# EAGLE design untitled (EAGLE 5.06)
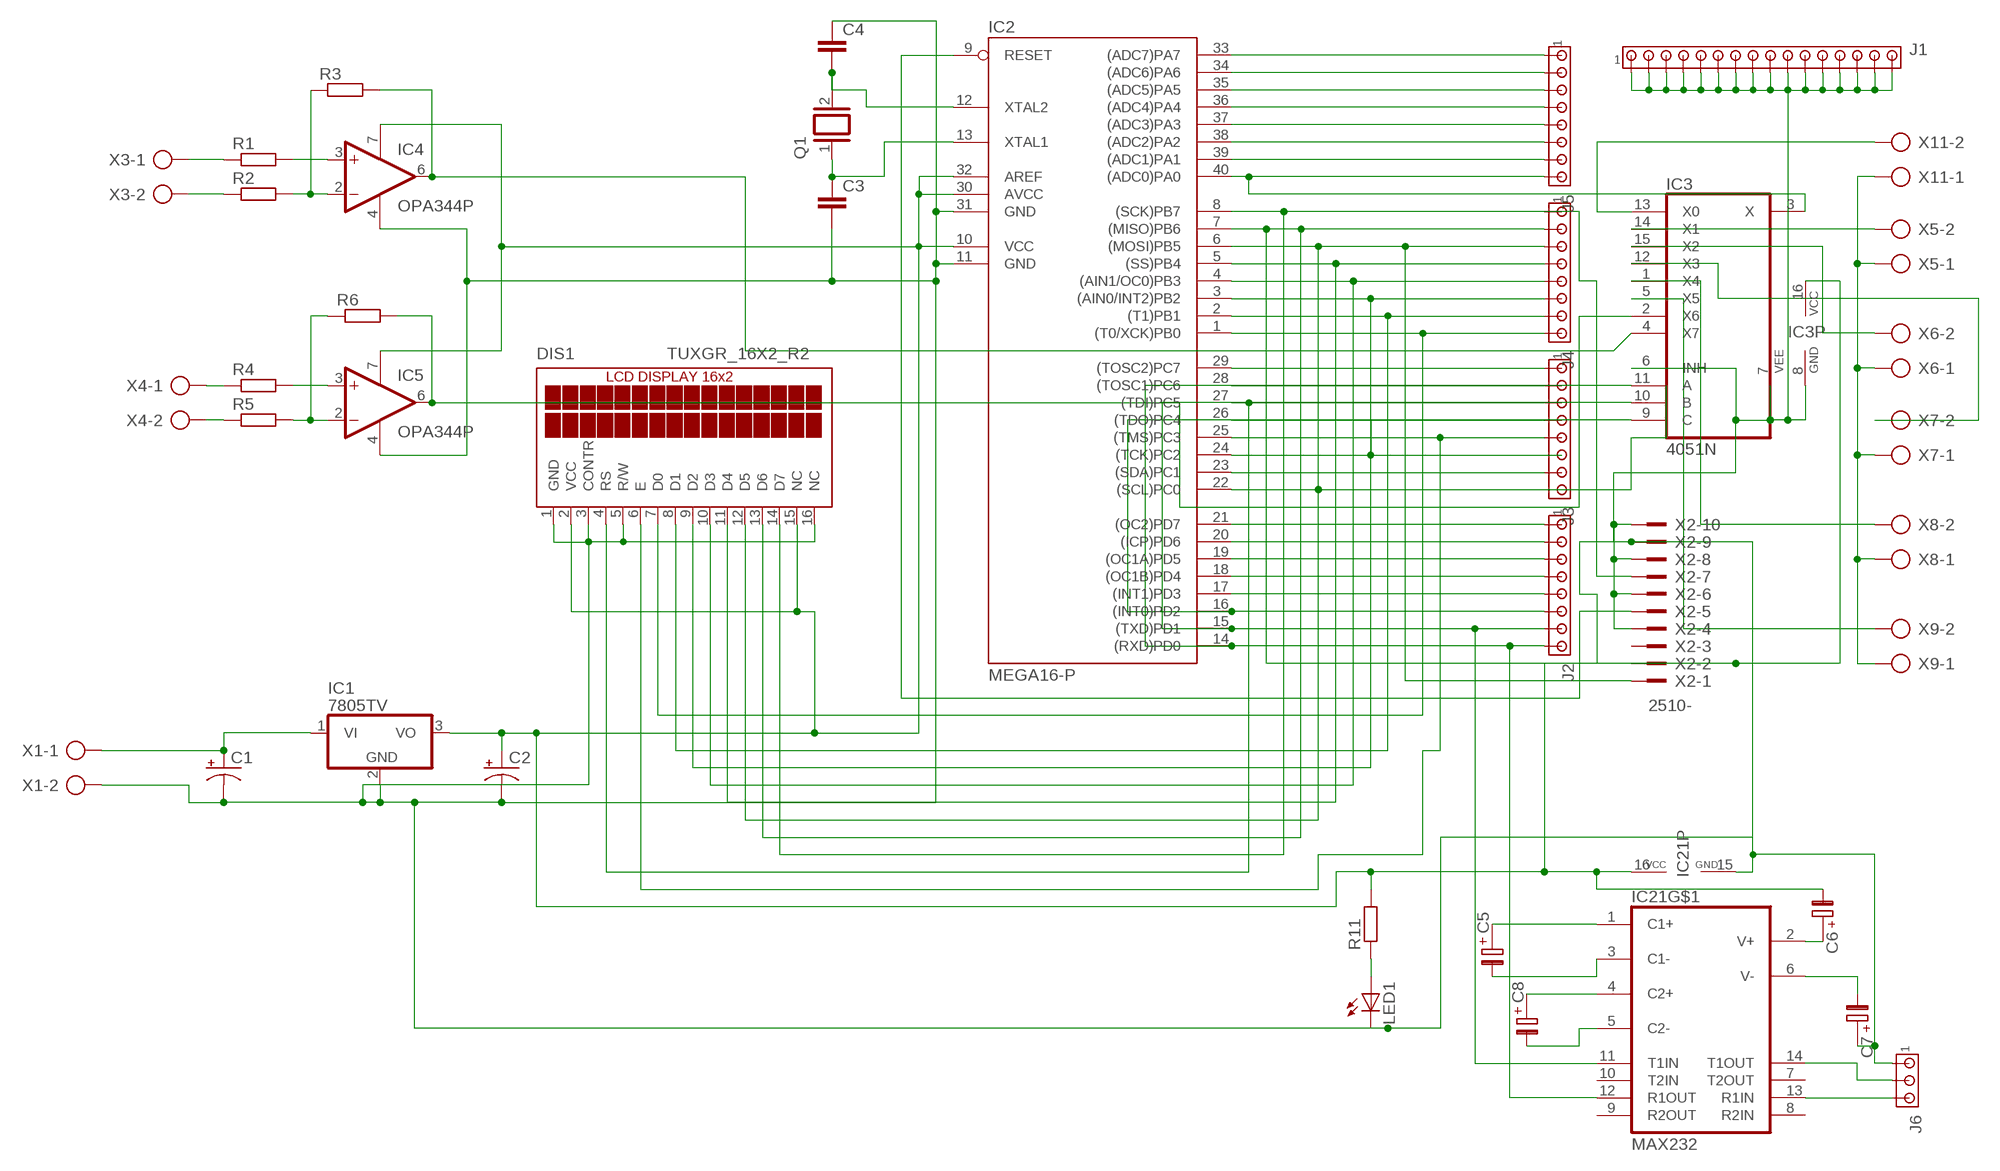
[diagram p0: schematic, sheet 1]

## Parts
C1  CPOL-USE5-8.5  [E5-8,5]
C2  CPOL-USE5-8.5  [E5-8,5]
C3  C2.5/2  [C2.5-2]
C4  C2.5/2  [C2.5-2]
C5  C-PR-2,5X6  [E2,5-6]
C6  C-PR-2,5X6  [E2,5-6]
C7  C-PR-2,5X6  [E2,5-6]
C8  C-PR-2,5X6  [E2,5-6]
DIS1  TUXGR_16X2_R2  [TUXGR_16X2_R2]
IC1  7805TV  [TO220V]
IC2  MEGA16-P  [DIL40]
IC3  4051N  [DIL16]
IC4  OPA344P  [DIL08]
IC5  OPA344P  [DIL08]
IC21  MAX232  [DIL16]
J1  MTA16-156  [1X16MTA]
J2  MTA08-100  [10X08MTA]
J3  MTA08-100  [10X08MTA]
J4  MTA08-100  [10X08MTA]
J5  MTA08-100  [10X08MTA]
J6  MTA03-100  [10X03MTA]
LED1  LED5MM  [LED5MM]
Q1  XTAL/S  [QS]
R1  R-EU_0204/7  [0204/7]
R2  R-EU_0204/7  [0204/7]
R3  R-EU_0204/7  [0204/7]
R4  R-EU_0204/7  [0204/7]
R5  R-EU_0204/7  [0204/7]
R6  R-EU_0204/7  [0204/7]
R11  R-EU_0207/10  [0207/10]
X1  AK300/2  [AK300/2]
X2  2510-  [PAK100/2500-10]
X3  AK300/2  [AK300/2]
X4  AK300/2  [AK300/2]
X5  AK300/2  [AK300/2]
X6  AK300/2  [AK300/2]
X7  AK300/2  [AK300/2]
X8  AK300/2  [AK300/2]
X9  AK300/2  [AK300/2]
X11  AK300/2  [AK300/2]

## Nets
N$1: C1.+ IC1.1(VI) X1.1
N$2: IC2.21((OC2)PD7) J2.1
N$3: IC2.33((ADC7)PA7) J5.1
N$4: IC2.23((SDA)PC1) J3.7
N$5: IC2.34((ADC6)PA6) J5.2
N$6: IC2.35((ADC5)PA5) J5.3
N$7: C4.2 IC2.12(XTAL2) Q1.2
N$8: C3.1 IC2.13(XTAL1) Q1.1
N$9: IC2.36((ADC4)PA4) J5.4
N$10: IC2.37((ADC3)PA3) J5.5
N$11: IC2.40((ADC0)PA0) IC3.3(X) J5.8
N$12: IC2.39((ADC1)PA1) J5.7
N$13: IC2.38((ADC2)PA2) J5.6
N$14: C2.+ C6.- DIS1.2(VCC) DIS1.15(NC) IC1.3(VO) IC2.10(VCC) IC2.30(AVCC) IC2.32(AREF) IC3.16(VCC) IC4.7(V+) IC5.7(V+) IC21.16(P:VCC) R11.2 X2.2
N$15: IC3.5(X5) X9.2
N$16: LED1.A R11.1
N$17: IC2.20((ICP)PD6) J2.2
N$19: IC3.4(X7) IC4.6(OUT) R3.2
N$20: IC4.2(-IN) R2.2 R3.1
N$21: IC5.3(+IN) R4.2
N$22: IC4.3(+IN) R1.2
N$23: R1.1 X3.1
N$24: R2.1 X3.2
N$25: IC3.2(X6) IC5.6(OUT) R6.2
N$26: IC5.2(-IN) R5.2 R6.1
N$27: R4.1 X4.1
N$28: R5.1 X4.2
N$29: IC2.22((SCL)PC0) J3.8
N$31: X5.1 X6.1 X7.1 X8.1 X9.1 X11.1
N$32: IC3.13(X0) X11.2
N$33: IC3.14(X1) X5.2
N$34: IC3.15(X2) X6.2
N$35: IC3.12(X3) X7.2
N$36: IC3.1(X4) X8.2
N$39: C1.- C2.- C3.2 C4.1 C7.+ DIS1.1(GND) DIS1.3(CONTR) DIS1.5(R/W) DIS1.16(NC) IC1.2(GND) IC2.11(GND) IC2.31(GND) IC3.6(INH) IC3.7(VEE) IC3.8(GND) IC4.4(V-) IC5.4(V-) IC21.15(P:GND) J1.1 J1.2 J1.3 J1.4 J1.5 J1.6 J1.7 J1.8 J1.9 J1.10 J1.11 J1.12 J1.13 J1.14 J1.15 J1.16 J6.1 LED1.K(C) X1.2 X2.4 X2.6 X2.8 X2.10
N$40: C5.+ IC21.1(C1+)
N$41: C5.- IC21.3(C1-)
N$42: C8.+ IC21.4(C2+)
N$43: IC2.29((TOSC2)PC7) J3.1
N$44: IC2.28((TOSC1)PC6) J3.2
N$45: DIS1.4(RS) IC2.27((TDI)PC5) J3.3
N$46: IC2.26((TDO)PC4) J3.4
N$48: IC2.24((TCK)PC2) J3.6
N$49: IC2.9(RESET) X2.5
N$51: DIS1.7(D0) IC2.1((T0/XCK)PB0) J4.8
N$52: DIS1.8(D1) IC2.2((T1)PB1) J4.7
N$53: DIS1.9(D2) IC2.3((AIN0/INT2)PB2) J4.6
N$54: DIS1.10(D3) IC2.4((AIN1/OC0)PB3) J4.5
N$55: DIS1.11(D4) IC2.5((SS)PB4) J4.4
N$56: DIS1.12(D5) IC2.6((MOSI)PB5) J4.3 X2.1
N$57: DIS1.13(D6) IC2.7((MISO)PB6) J4.2 X2.9
N$58: DIS1.14(D7) IC2.8((SCK)PB7) J4.1 X2.7
N$59: IC2.19((OC1A)PD5) J2.3
N$60: C8.- IC21.5(C2-)
N$61: IC2.18((OC1B)PD4) J2.4
N$62: IC2.17((INT1)PD3) J2.5
N$63: IC2.16((INT0)PD2) IC3.9(C) J2.6
N$65: DIS1.6(E) IC2.25((TMS)PC3) J3.5
N$67: C6.+ IC21.2(V+)
N$68: C7.- IC21.6(V-)
N$69: IC2.15((TXD)PD1) IC3.10(B) IC21.11(T1IN) J2.7
N$85: IC21.14(T1OUT) J6.2
N$87: IC21.13(R1IN) J6.3
N$89: IC2.14((RXD)PD0) IC3.11(A) IC21.12(R1OUT) J2.8
Unconnected: IC21.7(T2OUT) IC21.8(R2IN) IC21.9(R2OUT) IC21.10(T2IN) X2.3

## Library data of the parts
C1 C2 = resistor:CPOL-US: POLARIZED CAPACITOR, American symbol
C3 C4 = capacitor-wima:C: CAPACITOR naming: grid - package width
C5-C8 = cap-pan40:C-PR: POLARIZED ELECTROLYTIC/TANTALUM
DIS1 = display-lcd:TUXGR_16X2_R2: Tuxgraphics LCD display 16x2 characters reflective, without background light Source: tuxgr_12x2_r2.pdf
IC1 = linear:78*: Positive VOLTAGE REGULATOR Source: http://cache.national.com/ds/LM/LM78L05.pdf http://www.fairchildsemi.com/ds/LM/LM7805.pdf
IC2 = atmel:MEGA16-P: MICROCONTROLLER 16 Kbytes FLASH 1 kbytes SRAM 512 bytes EEPROM USART 8-channel 10 bit ADC Source: avr.lbr
IC3 = 40xx:4051: 8-channel ANALOG MULTIPLEXER
IC4 IC5 = linear3:OPA*: Single Operational Amplifier Low Power, Single-Supply, Rail-To-Rail Operational Amplifier Source: http://focus.ti.com/lit/ds/symlink/opa2345.pdf
IC21 = maxim:MAX232: RS232 TRANSEIVER
J1 = con-amp:MTA16-156: AMP connector
J2-J5 = con-amp:MTA08-100: AMP connector
J6 = con-amp:MTA03-100: AMP connector
LED1 = led:LED: LED OSRAM: - CHIPLED LG R971, LG N971, LY N971, LG Q971, LY Q971, LO R971, LY R971 LH N974, LH R974 LS Q976, LO Q976, LY Q976 LO Q996 - Hyper CHIPLED LW Q18S LB Q993, LB Q99A, LB R99A - SideLED LS A670, LO A670, LY A670, LG A670, LP A670 LB A673, LV A673, LT A673, LW A673 LH A674 LY A675 LS A676, LA A676, LO A676, LY A676, LW A676 LS A679, LY A679, LG A679 - Hyper Micro SIDELED® LS Y876, LA Y876, LO Y876, LY Y876 LT Y87S - SmartLED LW L88C, LW L88S LB L89C, LB L89S, LG L890 LS L89K, LO L89K, LY L89K LS L896, LA L896, LO L896, LY L896 - TOPLED LS T670, LO T670, LY T670, LG T670, LP T670 LSG T670, LSP T670, LSY T670, LOP T670, LYG T670 LG T671, LOG T671, LSG T671 LB T673, LV T673, LT T673, LW T673 LH T674 LS T676, LA T676, LO T676, LY T676, LB T676, LH T676, LSB T676, LW T676 LB T67C, LV T67C, LT T67C, LS T67K, LO T67K, LY T67K, LW E67C LS E67B, LA E67B, LO E67B, LY E67B, LB E67C, LV E67C, LT E67C LW T67C LS T679, LY T679, LG T679 LS T770, LO T770, LY T770, LG T770, LP T770 LB T773, LV T773, LT T773, LW T773 LH T774 LS E675, LA E675, LY E675, LS T675 LS T776, LA T776, LO T776, LY T776, LB T776 LHGB T686 LT T68C, LB T68C - Hyper Mini TOPLED® LB M676 - Mini TOPLED Santana® LG M470 LS M47K, LO M47K, LY M47K Source: http://www.osram.convergy.de LUXEON: - LUMILED® LXK2-PW12-R00, LXK2-PW12-S00, LXK2-PW14-U00, LXK2-PW14-V00 LXK2-PM12-R00, LXK2-PM12-S00, LXK2-PM14-U00 LXK2-PE12-Q00, LXK2-PE12-R00, LXK2-PE12-S00, LXK2-PE14-T00, LXK2-PE14-U00 LXK2-PB12-K00, LXK2-PB12-L00, LXK2-PB12-M00, LXK2-PB14-N00, LXK2-PB14-P00, LXK2-PB14-Q00 LXK2-PR12-L00, LXK2-PR12-M00, LXK2-PR14-Q00, LXK2-PR14-R00 LXK2-PD12-Q00, LXK2-PD12-R00, LXK2-PD12-S00 LXK2-PH12-R00, LXK2-PH12-S00 LXK2-PL12-P00, LXK2-PL12-Q00, LXK2-PL12-R00 Source: www.luxeon.com KINGBRIGHT: KA-3528ASYC Source: www.kingbright.com
Q1 = special:XTAL/S: CRYSTAL
R1-R6 R11 = rcl:R-EU_: RESISTOR, European symbol
X1 X3-X9 X11 = con-ptr500:AK300/2: CONNECTOR
X2 = con-3m:2510-: 3M (TM) Pak 100 4-Wall Header Source: 3M

## Board
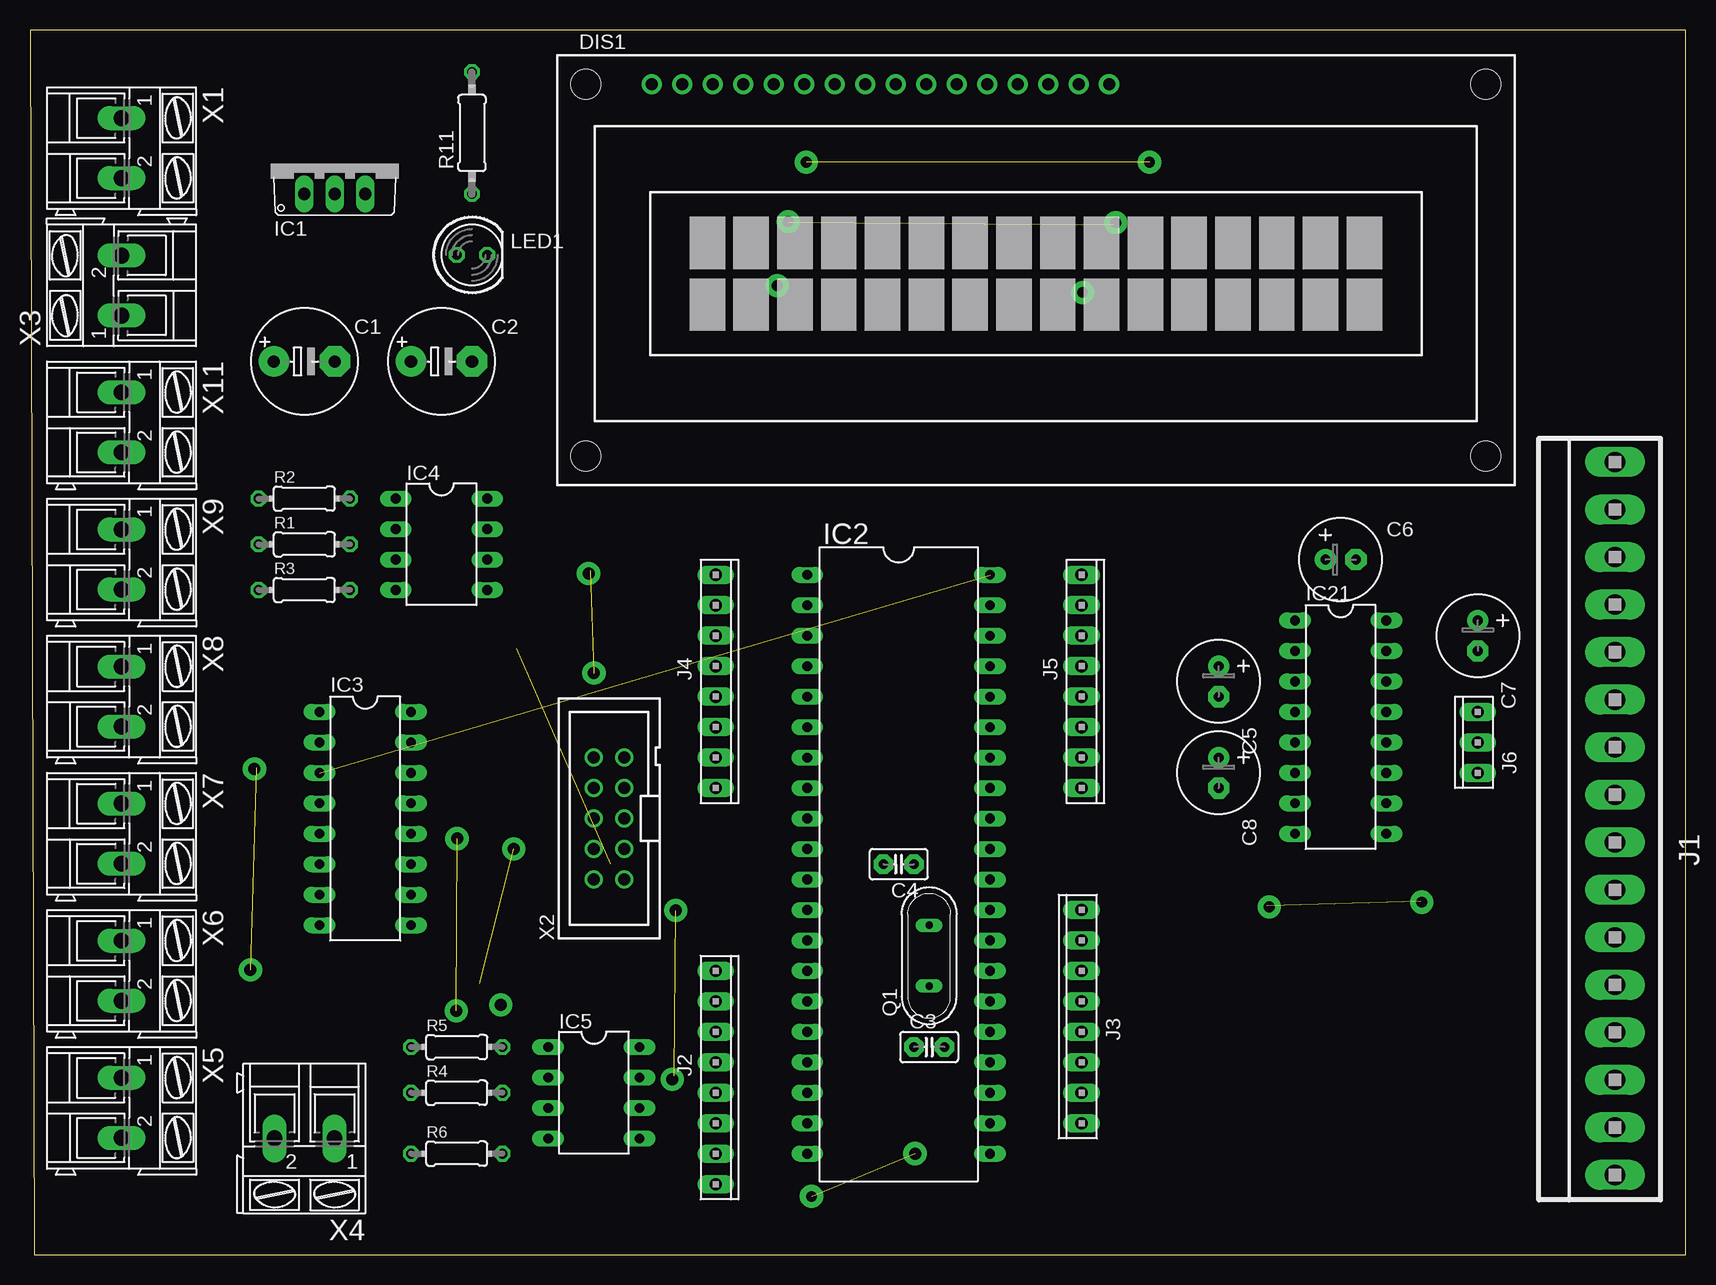
[diagram p1: board, top side]
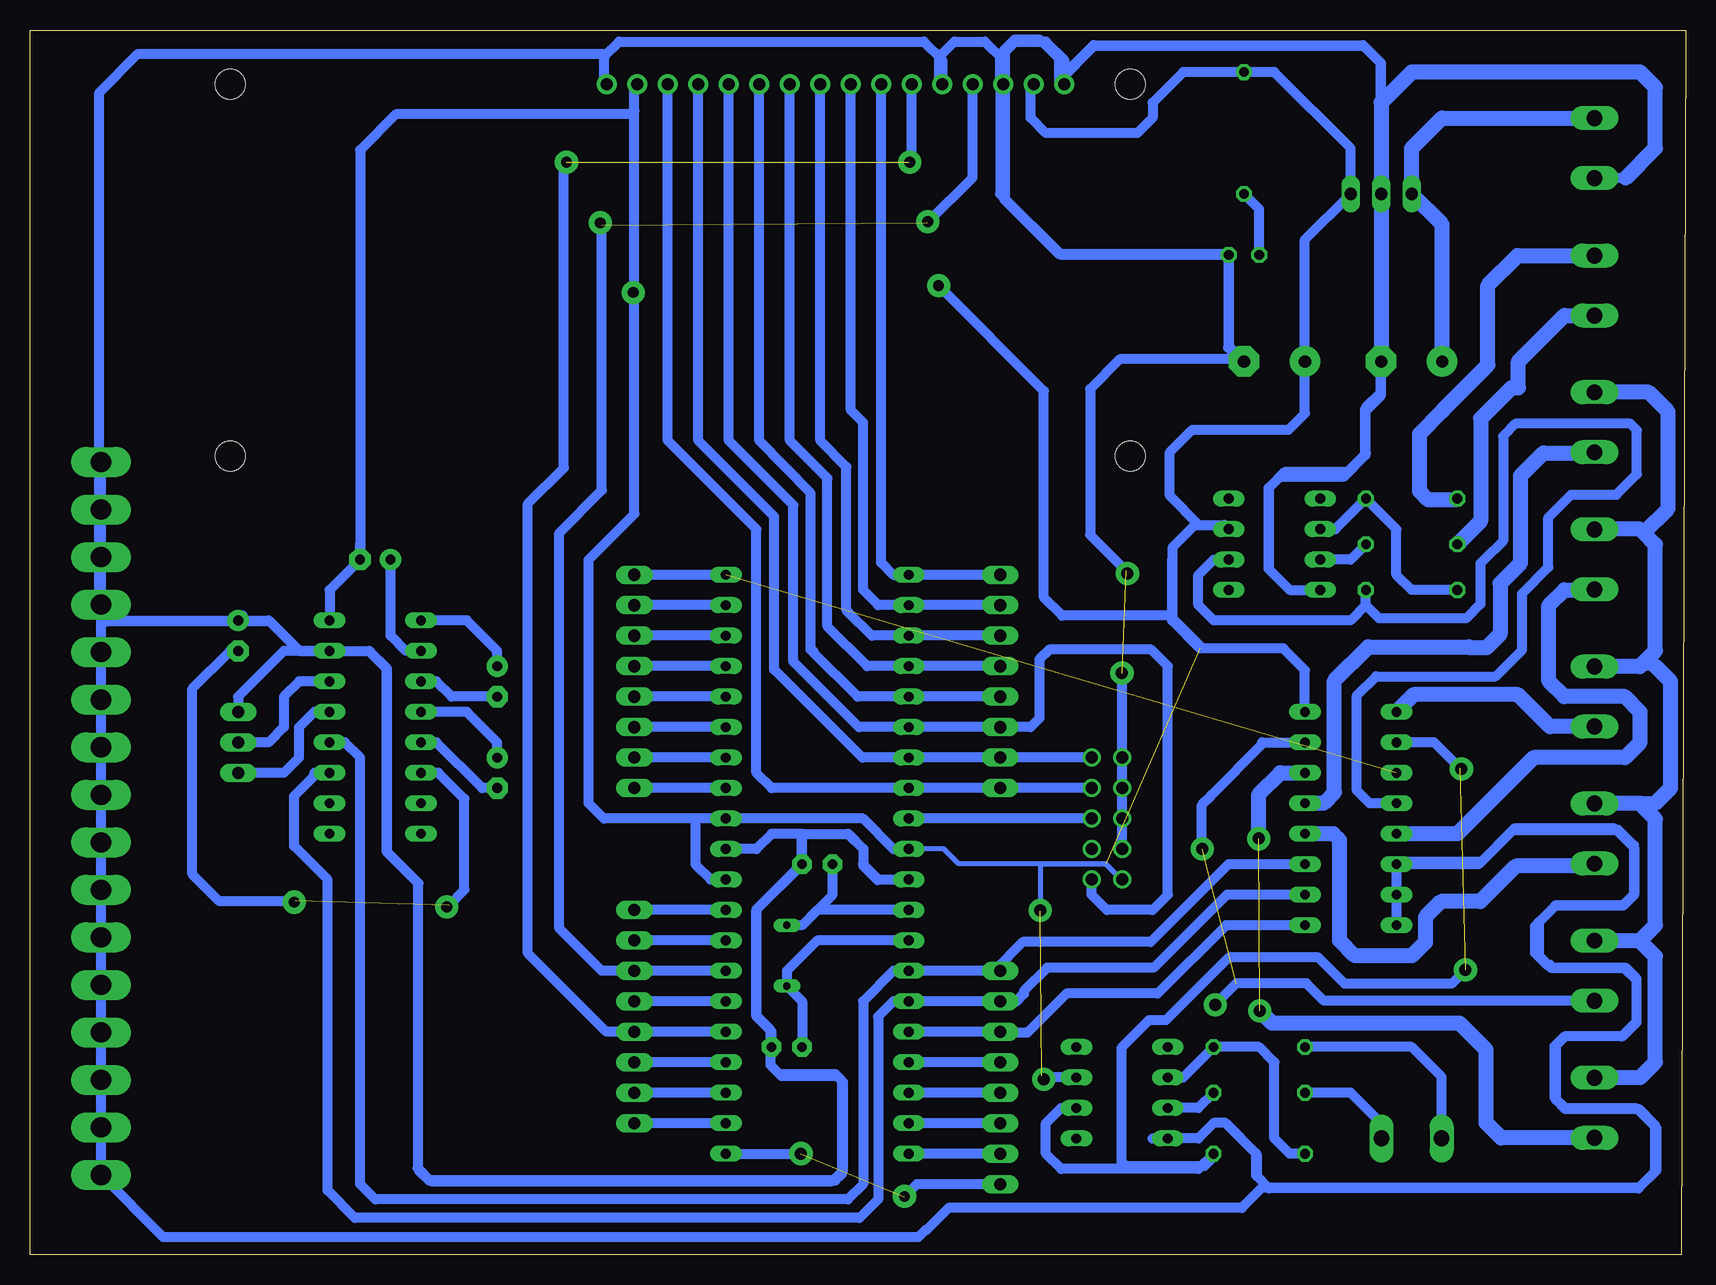
[diagram p2: board, bottom side, seen from below]

Size 138 x 102.06 mm. Coordinates in mm from the lower left corner, seen from the top.
Outline: 0.37,0 138,0 138,102.06 0,102.06 0.37,0
Copper layers (1*16): Top 0.035mm / dielectric 1.5mm / Bottom 0.035mm
Design rules "default": minimum track width 10mil, minimum drill 24mil, track to track 8mil, track to pad 8mil, pad to pad 8mil, via to via 8mil, smd to smd 8mil, copper to edge 40mil, drill to drill 8mil, minimum pad ring 10mil, minimum via ring 8mil, stop-mask expansion 4mil, vias tented up to drill 0mil, thermal gap 10mil

### Footprints (pad centres in the part's own frame; a part is rotated, then mirrored left to right if it is on the bottom)
E5-8,5 = drill 1.016 pad 2.54 round: + -2.54,0 | drill 1.016 pad 2.54 octagon: - 2.54,0
C2.5-2 = drill 0.813 pad 1.6 octagon: 1 -1.27,0; 2 1.27,0
E2,5-6 = drill 0.813 pad 1.778 round: + -1.27,0 | drill 0.813 pad 1.778 octagon: - 1.27,0
TUXGR_16X2_R2 = drill 1 pad 1.676 round: 1 -32,15.5; 2 -29.46,15.5; 3 -26.92,15.5; 4 -24.38,15.5; 5 -21.84,15.5; 6 -19.3,15.5; 7 -16.76,15.5; 8 -14.22,15.5; 9 -11.68,15.5; 10 -9.14,15.5; 11 -6.6,15.5; 12 -4.06,15.5; 13 -1.52,15.5; 14 1.02,15.5; 15 3.56,15.5; 16 6.1,15.5 | hole 2.5: -37.5,-15.5; 37.5,-15.5; -37.5,15.5; 37.5,15.5
TO220V = drill 1.016 long: 1 -2.54,-2.54; 2 0,-2.54; 3 2.54,-2.54
DIL40 = drill 0.813 long: 1 -24.13,-7.62; 2 -21.59,-7.62; 3 -19.05,-7.62; 4 -16.51,-7.62; 5 -13.97,-7.62; 6 -11.43,-7.62; 7 -8.89,-7.62; 8 -6.35,-7.62; 9 -3.81,-7.62; 10 -1.27,-7.62; 11 1.27,-7.62; 12 3.81,-7.62; 13 6.35,-7.62; 14 8.89,-7.62; 15 11.43,-7.62; 16 13.97,-7.62; 17 16.51,-7.62; 18 19.05,-7.62; 19 21.59,-7.62; 20 24.13,-7.62; 21 24.13,7.62; 22 21.59,7.62; 23 19.05,7.62; 24 16.51,7.62; 25 13.97,7.62; 26 11.43,7.62; 27 8.89,7.62; 28 6.35,7.62; 29 3.81,7.62; 30 1.27,7.62; 31 -1.27,7.62; 32 -3.81,7.62; 33 -6.35,7.62; 34 -8.89,7.62; 35 -11.43,7.62; 36 -13.97,7.62; 37 -16.51,7.62; 38 -19.05,7.62; 39 -21.59,7.62; 40 -24.13,7.62
DIL16 = drill 0.813 long: 1 -8.89,-3.81; 2 -6.35,-3.81; 3 -3.81,-3.81; 4 -1.27,-3.81; 5 1.27,-3.81; 6 3.81,-3.81; 7 6.35,-3.81; 8 8.89,-3.81; 9 8.89,3.81; 10 6.35,3.81; 11 3.81,3.81; 12 1.27,3.81; 13 -1.27,3.81; 14 -3.81,3.81; 15 -6.35,3.81; 16 -8.89,3.81
DIL08 = drill 0.813 long: 1 -3.81,-3.81; 2 -1.27,-3.81; 3 1.27,-3.81; 4 3.81,-3.81; 5 3.81,3.81; 6 1.27,3.81; 7 -1.27,3.81; 8 -3.81,3.81
1X16MTA = drill 1.676 long: 1 29.718,0; 2 25.756,0; 3 21.793,0; 4 17.831,0; 5 13.868,0; 6 9.906,0; 7 5.944,0; 8 1.981,0; 9 -1.981,0; 10 -5.944,0; 11 -9.906,0; 12 -13.868,0; 13 -17.831,0; 14 -21.793,0; 15 -25.756,0; 16 -29.718,0
10X08MTA = drill 1.016 long: 1 8.89,0; 2 6.35,0; 3 3.81,0; 4 1.27,0; 5 -1.27,0; 6 -3.81,0; 7 -6.35,0; 8 -8.89,0
10X03MTA = drill 1.016 long: 1 2.54,0; 2 0,0; 3 -2.54,0
LED5MM = drill 0.813 octagon: A -1.27,0; K 1.27,0
QS = drill 0.61 long: 1 -2.54,0; 2 2.54,0
0204/7 = drill 0.813 octagon: 1 -3.81,0; 2 3.81,0
0207/10 = drill 0.813 octagon: 1 -5.08,0; 2 5.08,0
AK300/2 = drill 1.321 long: 1 -2.515,0; 2 2.489,0
PAK100/2500-10 = drill 1 pad 1.422 round: 1 -5.08,-1.27; 2 -5.08,1.27; 3 -2.54,-1.27; 4 -2.54,1.27; 5 0,-1.27; 6 0,1.27; 7 2.54,-1.27; 8 2.54,1.27; 9 5.08,-1.27; 10 5.08,1.27

### Placement (x,y rotation side)
C1  22.86,74.45 0 top
C2  34.29,74.45 0 top
C3  74.93,17.3 0 top
C4  72.39,32.54 180 top
C5  99.06,47.78 270 top
C6  109.22,57.94 0 top
C7  120.65,51.59 270 top
C8  99.06,40.16 270 top
DIS1  83.82,82.07 0 top
IC1  25.4,90.96 0 top
IC2  72.39,32.54 270 top
IC3  27.94,36.35 270 top
IC4  34.29,59.21 270 top
IC5  46.99,13.49 270 top
IC21  109.22,43.97 270 top
J1  132.08,36.35 90 top
J2  57.15,14.76 270 top
J3  87.63,19.84 90 top
J4  57.15,47.78 270 top
J5  87.63,47.78 270 top
J6  120.65,42.7 90 top
LED1  36.83,83.34 0 top
Q1  74.93,24.92 90 top
R1  22.86,59.21 0 top
R2  22.86,63.02 0 top
R3  22.86,55.4 0 top
R4  35.56,13.49 0 top
R5  35.56,17.3 0 top
R6  35.56,8.41 0 top
R11  36.83,93.5 90 top
X1  7.62,92.23 270 top
X2  48.26,36.35 90 top
X3  7.62,80.8 90 top
X4  22.86,9.68 180 top
X5  7.62,12.22 270 top
X6  7.62,23.65 270 top
X7  7.62,35.08 270 top
X8  7.62,46.51 270 top
X9  7.62,57.94 270 top
X11  7.62,69.37 270 top

### Tracks (layer width: path | path; a pad name or v marks a point on that pad's centre or on a via)
N$1
  Bottom 1.27: X1.1 20.35,94.75 22.86,92.23 IC1.1 20.32,85.88 C1.+
N$2  (via drill 1 pad 1.93)  (1 unrouted)
  Bottom 0.813: J2.1 64.1,5.87 65.16,4.81 | IC2.21 v73.76,8.41 v73.75,8.42
N$3
  Bottom 0.813: IC2.33 J5.1
N$4
  Bottom 0.813: IC2.23 J3.7
N$5
  Bottom 0.813: IC2.34 J5.2
N$6
  Bottom 0.813: IC2.35 J5.3
N$7
  Bottom 0.813: 73.66,27.46 Q1.2 | 73.66,27.46 71.12,30 C4.2 | IC2.12 72.39,28.73 73.66,27.46
N$8
  Bottom 0.813: IC2.13 72.39,26.19 74.93,23.65 Q1.1 73.66,21.11 C3.1
N$9
  Bottom 0.813: IC2.36 J5.4
N$10
  Bottom 0.813: IC2.37 J5.5
N$11  (1 unrouted)
  Bottom 0.813: IC2.40 J5.8
N$12
  Bottom 0.813: IC2.39 J5.7
N$13
  Bottom 0.813: IC2.38 J5.6
N$14  (via drill 0.9 pad 1.93)  (2 unrouted)
  Bottom 0.406: 47.04,31.27 48.22,32.45 | 48.22,32.45 | 48.22,32.45 48.34,32.57 60.61,32.57 61.87,33.83 64.75,33.83 IC2.10 | X2.2 47.04,31.27 | 47.04,31.27 48.28,32.51 53.76,32.51 53.82,32.45 53.82,28.64 53.84,28.62
  Bottom 0.813: DIS1.2 54.61,97.32 54.61,94.77 53.34,93.5 45.72,93.5 44.45,94.77 44.45,96.04 41.91,98.58 R11.2 34.29,98.58 27.94,92.23 IC1.3 31.75,84.61 C2.+ 31.75,70.13 33.1,68.77 41.14,68.77 43.02,66.9 43.02,63.26 40.59,60.83 | IC21.16 113.03,55.4 C6.- | C6.- 110.49,59.21 | 82.55,36.35 IC2.32 68.58,36.35 66.04,33.81 IC2.10 | 82.55,36.35 90.17,36.35 91.44,37.62 91.44,57.94 87.63,61.75 87.63,95.35 | DIS1.15 87.63,97.32 87.63,95.35 | IC2.30 81.28,31.27 82.55,32.54 82.55,36.35 | IC3.16 31.75,48.72 33.56,50.53 40.25,50.53 | 40.25,50.53 42.76,53.04 42.76,58.99 40.92,60.83 40.59,60.83 | 40.59,60.83 38.45,60.83 IC4.7 | C6.- 110.49,92.07 107.51,95.05 87.93,95.05 87.63,95.35 | 40.25,50.53 40.51,50.53 42.83,52.85 42.83,53.46 | 62.09,80.77 v62.28,80.77 53.5,71.99 53.5,54.79 51.98,53.27 43.03,53.27 42.83,53.46 | IC5.7 53.54,14.76 53.67,14.89 | 42.83,53.46 42.83,57.92
N$15
  Bottom 0.813: 7.67,55.4 X9.2
  Bottom 1.27: IC3.5 19.05,35.08 12.7,41.43 5.08,41.43 3.81,42.7 3.81,45.24 5.08,46.51 10.16,46.51 11.43,47.78 11.43,54.13 10.16,55.4 7.67,55.4
N$16
  Bottom 0.813: LED1.A 35.56,87.15 R11.1
N$17
  Bottom 0.813: J2.2 IC2.20
N$18  (via drill 0.9 pad 1.93)
  other vias: 103.27,28.99
N$19
  Bottom 0.813: 26.67,54.13 R3.2 | 26.67,54.13 27.94,52.86 39.37,52.86 40.64,54.13 40.64,56.67 39.37,57.94 IC4.6 | IC3.4 26.36,37.62 27.42,38.68 27.42,46.62 25.83,48.21 15.85,48.21 13.66,50.4 13.66,55.1 11.47,57.3 11.47,61.45 9.58,63.34 5.8,63.34 4.09,65.05 4.09,68.71 4.64,69.26 14.21,69.26 15.25,68.23 15.25,59.5 16.89,57.85 16.91,57.85 17.13,57.63 17.13,54.22 18.33,53.03 25.57,53.03 26.67,54.13
N$20
  Bottom 0.813: IC4.2 29.21,60.48 R2.2 24.13,60.48 24.13,56.67 22.86,55.4 R3.1
N$21
  Bottom 0.813: R4.2 40.64,12.22 IC5.3
N$22
  Bottom 0.813: R1.2 27.94,57.94 IC4.3
N$23
  Bottom 1.27: X3.1 10.14,78.29 13.97,74.45 13.97,72.25 14.58,72.25 17.11,69.71 17.11,61.15 R1.1
N$24
  Bottom 0.813: 20.31,70.3 20.31,70.36 | 19.16,62.92 R2.1
  Bottom 1.27: X3.2 14.02,83.29 16.51,80.8 16.51,74.16 20.31,70.36 | 20.31,70.3 22.2,68.41 22.2,63.65 21.47,62.92 19.16,62.92
N$25  (via drill 1 pad 1.93)  (1 unrouted)
  Bottom 0.813: IC5.6 52.07,12.22 53.34,10.95 53.34,8.41 52.07,7.14 40.64,7.14 R6.2 | R6.2 39.37,8.38 40.33,7.42 40.42,7.42 40.67,7.17 | R6.2 39.37,8.13 40.12,7.39 46.72,7.39 47.04,7.71 47.04,17.23 44.75,19.53 43.33,19.53 38.1,24.76 30.63,24.76 28.45,22.57 19.53,22.57 v18.37,23.73 | IC3.2 20.99,42.7 18.86,40.57
N$26
  Bottom 0.813: IC5.2 41.91,14.76 R5.2 35.56,17.3 34.29,16.03 34.29,9.68 33.02,8.41 R6.1
N$27
  Bottom 0.813: R4.1 27.94,13.49 25.4,10.95 25.4,9.71 X4.1
N$28
  Bottom 0.813: X4.2 20.37,14.81 22.86,17.3 R5.1
N$29
  Bottom 0.813: IC2.22 J3.8
N$30  (via drill 0.9 pad 1.93)
  other vias: 115.98,29.39
N$31
  Bottom 0.813: 7.6,60.48 X9.1 | 3.84,49.03 3.81,49.05 2.54,49.05 | 3.52,60.19 3.81,60.48 | 3.84,37.6 3.81,37.62
  Bottom 1.27: 3.81,60.48 7.6,60.48 | 3.84,49.03 X8.1 | 3.81,49.05 2.54,50.32 2.54,59.21 3.52,60.19 1.5,62.21 1.5,70.27 3.11,71.89 X11.1 | X7.1 3.84,37.6 2.54,36.3 2.54,27.46 3.84,26.17 | 3.84,26.17 X6.1 | X5.1 3.84,14.74 2.54,16.03 2.54,24.87 3.84,26.17 | 2.54,49.05 1.27,47.78 1.27,38.89 2.54,37.62 3.81,37.62
N$32
  Bottom 0.813: 7.68,66.82 X11.2
  Bottom 1.27: IC3.13 30.21,37.62 29.29,38.53 29.29,47.85 26.48,50.67 18.1,50.67 18.02,50.59 16.62,50.59 15.49,51.72 15.49,55.96 13.78,57.67 13.78,64.93 11.89,66.82 7.68,66.82
N$33  (via drill 1 pad 1.93)  (1 unrouted)
  Bottom 1.27: X5.2 15.4,9.73 16.65,10.98 16.65,17.07 18.87,19.29 34.48,19.29 v35.51,20.32 | IC3.14 33.82,40.16 35.59,38.4 v35.59,34.67
N$34  (via drill 1 pad 1.93)  (1 unrouted)
  Bottom 0.813: IC3.15 35.31,42.7 35.31,42.55 39.58,38.28 39.58,38.24 40.35,37.47 40.35,33.87 v40.31,33.83 | X6.2 30.18,21.16 31.64,22.63 37.47,22.63 39.2,20.9
N$35
  Bottom 0.813: 7.82,32.39 X7.2
  Bottom 1.27: IC3.12 29.38,35.08 28.86,34.56 28.86,26.18 27.58,24.9 22.84,24.9 21.72,26.02 21.72,28.13 20.43,29.43 17.14,29.43 14.17,32.39 7.82,32.39
N$36
  Bottom 1.27: X8.2 11.34,44.02 14,46.68 22.7,46.68 IC3.1
N$37  (via drill 0.9 pad 1.93)
  other vias: 64.68,91.07
N$38  (via drill 0.9 pad 1.93)
  other vias: 63.18,86.1
N$39  (2 unrouted)
  Bottom 0.813: 51.82,98.38 51.82,99.6 53.34,101.12 55.88,101.12 57.15,99.85 57.15,97.82 DIS1.3 | 51.82,98.38 DIS1.1 | DIS1.3 56.9,99.6 58.42,101.12 60.96,101.12 62.23,99.85 62.23,97.82 DIS1.5 61.98,99.6 63.5,101.12 88.9,101.12 90.1,99.92 | 90.1,99.92 90.17,99.85 90.17,97.82 DIS1.16 | C1.- 25.4,71.91 26.67,70.64 26.67,66.78 28.24,65.21 33.48,65.21 | C2.- 38.1,75.72 LED1.K 52.07,83.34 57.15,88.42 57.15,97.32 DIS1.3 | 5.03,89.74 X1.2 | IC4.4 33.02,55.4 34.79,57.17 | IC2.11 67.31,31.27 68.58,32.54 68.58,33.81 69.85,35.08 73.66,35.08 | 73.66,35.08 76.2,35.08 77.47,33.81 IC2.31 | 73.66,35.08 C4.1 77.47,28.73 77.47,19.84 76.2,18.57 C3.2 | 114.3,50.32 IC21.15 109.76,50.32 108.3,48.86 108.3,33.62 105.7,31.02 105.7,7.22 104.59,6.11 71.13,6.11 70.23,7.01 70.23,14.38 70.72,14.87 75.37,14.87 76.29,15.79 76.29,17.21 C3.2 | 114.3,50.32 115.57,50.32 118.11,52.86 C7.+ 120.28,53.23 120.28,53.29 120.72,52.86 132.08,52.86 | J6.1 120.65,46.51 116.84,50.32 114.3,50.32 | 44.45,9.68 IC5.4 40.64,9.68 39.35,10.97 38.36,10.97 | 35.84,6.65 35.84,8.46 38.36,10.97 | C3.2 76.29,17.21 | X2.10 X2.8 X2.6 X2.4 46.99,48.42 47,48.43 | J1.1 J1.2 J1.3 J1.4 132.08,52.86 | J1.5 132.08,52.86 | J1.5 132.08,49.05 | J1.5 J1.6 J1.7 J1.8 J1.9 J1.10 J1.11 J1.12 J1.13 J1.14 J1.15 J1.16 126.9,1.45 63.97,1.45 63.36,2.06 63.27,2.06 61.44,3.9 37,3.9 35.34,5.56 3.93,5.56 2.44,7.04 2.44,10.53 4.1,12.19 10.12,12.19 10.82,12.89 10.82,17.43 10.04,18.22 5.24,18.22 4.1,19.35 4.1,23.02 4.98,23.9 11.08,23.9 11.35,24.16 11.61,24.16 12.57,25.12 12.57,27.39 10.82,29.14 5.24,29.14 4.28,30.1 4.28,33.85 5.94,35.51 14.31,35.51 17.28,32.54 IC3.6
  Bottom 0.813: IC3.6 IC3.7 IC3.8 IC3.6 | 33.48,65.21 34.79,63.9 34.79,57.17 | 33.48,65.21 28.24,65.21 26.75,66.71 26.75,70.28 25.44,71.59 25.44,99.32 26.93,100.82 49.38,100.82 51.82,98.38 | 38.36,10.97 38.36,10.95 35.78,8.37 | 35.78,8.37 35.78,6.73 | 67.38,31.22 68.54,32.38 68.54,33.83 69.78,35.06 73.41,35.06 73.68,34.79 73.68,32.66 73.82,32.52 73.82,32.45 77.45,28.82 77.45,19.9 76.29,18.73 76.29,15.78 75.53,15.03 70.87,15.03 70.33,14.48 70.33,6.73 70.87,6.18 104.73,6.18 105.62,7.07 105.62,30.95 108.23,33.55 108.23,48.85 109.67,50.29 115.49,50.29 117.96,52.76 131.67,52.76 132.22,53.31 132.22,96.87 129,100.1 90.27,100.1 90.1,99.92 | IC3.6 24.13,32.6 23.94,32.79 17.03,32.79 14.4,35.42 5.64,35.42 4.34,34.12 4.34,29.96 5.23,29.08 10.89,29.08 12.28,27.69 12.28,24.92 11.27,23.92 5.16,23.92 4.16,22.91 4.16,19.38 5.35,18.18 10.14,18.18 10.96,17.37 10.96,13.08 10.01,12.14 3.9,12.14 2.58,10.82 2.58,6.91 3.97,5.53 34.76,5.53 35.78,6.55 35.78,8.37 | 34.79,57.17 34.79,63.91 33.83,64.87 28.47,64.87 26.71,66.63 26.71,70.55 25.43,71.83 25.43,99.36 26.79,100.72 49.34,100.72 52.22,97.84 52.22,99.68 53.82,101.28 55.98,101.28 56.78,100.48 56.78,87.91 52.3,83.43 38.55,83.43 38.15,83.03 38.15,75.59 37.19,74.63 47.18,74.63 49.66,72.15 49.66,59.99 46.7,57.03
  Bottom 1.27: C1.- IC1.2 25.4,96.04 22.86,98.58 3.81,98.58 2.54,97.31 2.54,92.23 5.03,89.74
N$40
  Bottom 0.813: C5.+ 99.06,50.32 101.6,52.86 IC21.1
N$41
  Bottom 0.813: IC21.3 104.14,47.78 102.87,46.51 C5.-
N$42
  Bottom 0.813: C8.+ 99.06,42.7 101.6,45.24 IC21.4
N$43
  Bottom 0.813: IC2.29 J3.1
N$44
  Bottom 0.813: IC2.28 J3.2
N$45  (1 unrouted)
  Bottom 0.813: J3.3 IC2.27 90.37,23.65 93.89,27.17 93.89,60.16 90.33,63.71 90.33,85.83 90.52,86.01 | DIS1.4 59.44,89.79 63.22,86.01
N$46
  Bottom 0.813: IC2.26 J3.4
N$47  (via drill 0.9 pad 1.93)
  other vias: 90.47,86.01
N$48
  Bottom 0.813: IC2.24 J3.6
N$49
  Bottom 0.813: X2.5 IC2.9
N$50  (via drill 0.9 pad 1.93)
  other vias: 93.29,91.07
N$51
  Bottom 0.813: DIS1.7 67.06,57.69 66.04,56.67 | 66.04,56.67 IC2.1 | J4.8 66.04,56.67
N$52
  Bottom 0.813: J4.7 IC2.2 67.31,54.13 68.58,55.4 68.58,69.37 69.6,70.39 DIS1.8
N$53
  Bottom 0.813: DIS1.9 72.14,67.85 69.96,65.67 69.96,53.71 69.79,53.54 | J4.6 IC2.3 67.84,51.59 69.79,53.54 | 69.79,53.54
N$54
  Bottom 0.813: DIS1.10 74.68,67.85 71.55,64.72 71.55,52.37 68.23,49.05 IC2.4 J4.5
N$55
  Bottom 0.813: DIS1.11 77.22,67.85 72.94,63.48 72.94,50.41 72.72,50.28 72.72,50.2 69.04,46.51 IC2.5 J4.4
N$56
  Bottom 0.813: DIS1.12 79.76,67.85 74.39,62.48 74.39,49.44 68.92,43.97 IC2.6 58.42,43.97 | 58.42,43.97 J4.3 | X2.1 49.53,30 48.26,28.73 44.45,28.73 43.18,30 43.18,49.05 44.56,50.43 53.07,50.43 53.87,49.63 53.87,44.71 54.61,43.97 58.42,43.97
N$57
  Bottom 0.813: DIS1.13 82.3,67.85 76.63,62.18 | 76.63,62.18 76.2,61.75 | X2.9 J4.2 IC2.7 68.64,41.43 75.98,48.77 75.98,61.53 76.63,62.18
N$58
  Bottom 0.813: DIS1.14 84.84,67.85 77.47,60.48 77.47,40.16 76.2,38.89 IC2.8 J4.1 X2.7
N$59
  Bottom 0.813: J2.3 IC2.19
N$60
  Bottom 0.813: C8.- 100.33,38.89 104.14,42.7 IC21.5
N$61
  Bottom 0.813: J2.4 IC2.18
N$62
  Bottom 0.813: J2.5 IC2.17
N$63
  Bottom 0.813: J2.6 IC2.16 | J2.6 56.9,18.82 | IC3.9 38.32,27.46 44.02,21.76 51.61,21.76 54.87,18.5 57.08,18.5 J2.6
N$64  (via drill 0.9 pad 1.93)
  other vias: 87.72,80.21
N$65  (1 unrouted)
  Bottom 0.813: J3.5 IC2.25 89.97,18.57 96.51,25.11 96.51,62.6 93.51,65.59 93.51,90.89 93.33,91.07 | DIS1.6 64.52,91.27 64.71,91.07
N$67
  Bottom 0.813: C6.+ 107.95,51.59 106.68,50.32 IC21.2
N$68  (1 unrouted)
  Bottom 0.813: C7.- 121.31,50.32 124.46,47.17 124.46,31.7 122.21,29.45 115.92,29.45 115.88,29.49 | IC21.6 103.96,40.16 101.79,37.99 101.79,30.41 103.08,29.13
N$69
  Bottom 0.813: J2.7 IC2.15 66.04,21.11 67.31,19.84 67.31,4.6 68.86,3.06 110.92,3.06 113.2,5.34 113.2,31.27 115.98,34.05 115.98,38.23 114.3,39.91 114.3,40.16 IC21.11 | J2.7 56.86,21.41 | IC3.10 38.27,30 44.36,23.91 53.24,23.91 55.17,21.97 55.17,21.72 55.86,21.03 57.07,21.03 J2.7
N$71  (via drill 0.9 pad 1.93)
  other vias: 65.12,4.85
N$79  (via drill 1 pad 1.93)
  other vias: 39.23,20.82
N$80  (via drill 1 pad 1.93)
  other vias: 53.52,14.6
N$81  (via drill 1 pad 1.93)
  other vias: 53.82,28.69
N$82  (via drill 1 pad 1.93)
  other vias: 47,48.47
N$83  (via drill 1 pad 1.93)
  other vias: 46.54,56.79
N$84  (via drill 1 pad 1.93)
  other vias: 18.71,40.49
N$85
  Bottom 0.813: IC21.14 115.57,47.78 116.84,46.51 116.84,43.97 118.11,42.7 J6.2
N$87
  Bottom 0.813: IC21.13 114.3,45.24 115.57,43.97 115.57,41.43 116.84,40.16 J6.3
N$89
  Bottom 0.813: 57.84,23.65 IC2.14 66.04,23.65 68.58,21.11 68.58,5.87 69.85,4.6 109.22,4.6 110.49,5.87 110.49,41.43 111.76,42.7 IC21.12 | 57.66,23.65 57.84,23.65 | 57.66,23.65 J2.8 | 57.84,23.65 57.81,23.68 | IC3.11 38.13,32.54 44.62,26.05 55.26,26.05 57.66,23.65